# EasyEDA Pro project LeTian-robot2（轮腿机器人）.eprj, board Encoder-PCB
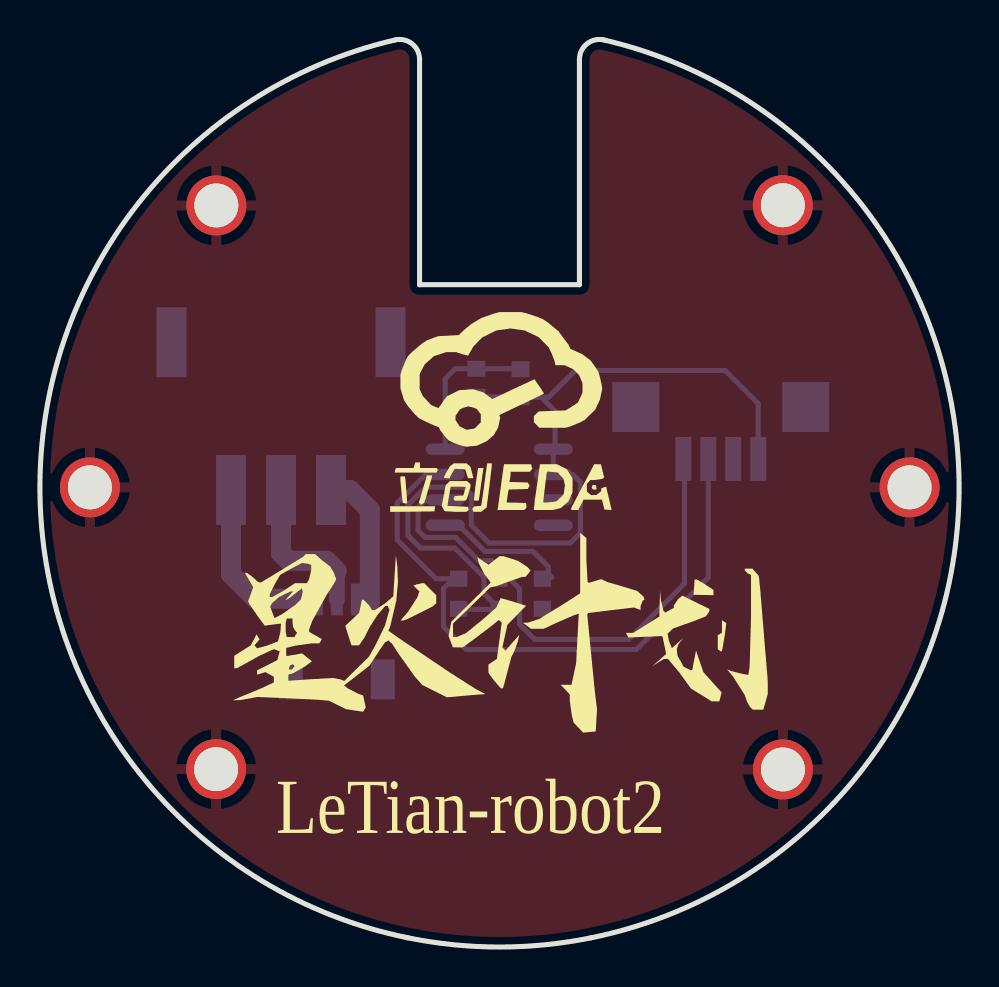
[diagram p8: board, top side]
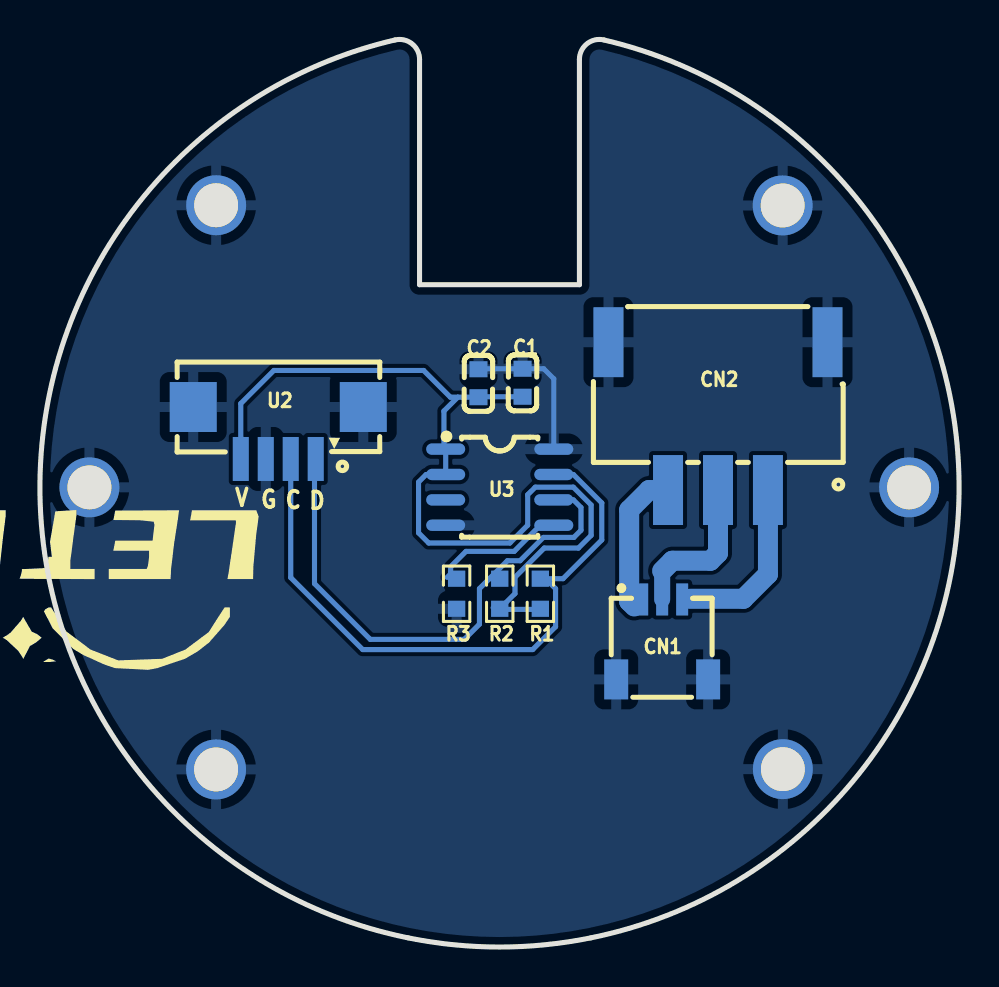
[diagram p9: board, bottom side, seen from below]

Outline 45.99 x 45.4 mm; copper layers: Top Layer, Bottom Layer. Coordinates in mm from the lower left corner of the outline.
Outline path: 17.77,45.4 arc(18.62,45.21) 19,44.42 19,33.15 27,33.15 27,44.42 arc(27.38,45.21) 28.22,45.4 arc(45.99,22.66) 27.57,0.46 arc(23,0) 18.43,0.46 arc(0,22.66) 17.77,45.4
Stack: Top Layer 0.035mm / Dielectric1 1.51mm FR4 er 4.5 / Bottom Layer 0.035mm

## Design rules (mm)
spacing safeClearance (default): track to track 0.152, other pairs 0.152 to 0.3
track width trackWidth (default): min 0.127, default 0.254, max 2.54
differential pair differentialPair (default): width min 0.127, default 0.254, max 2.54; gap min 0.152, default 0.152
via viaSize (default): diameter min 0.5, default 0.61, max 10; hole min 0.3, default 0.305, max 6

## Placement (name value [footprint] x y rotation side)
C1  0.1uF  [C0603]  21.84 28.24 90 bottom
C2  10uF  [C0603]  24.05 28.22 90 bottom
CN1  1.0K-BH-3PWB  [CONN-SMD_3P-P1.00_HDGC_1.0K-BH-3PWB]  14.86 15.4 180 bottom
CN2  WAFER-XH2.54-3PWB  [CONN-SMD_3P-P2.50_XUNPU_WAFER-XH2.54-3PWB]  12.06 26.57 0 bottom
NOREF  -  [Pad_e143]  8.82 8.9 0 top
NOREF#2  -  [Pad_e142]  37.18 8.89 0 top
NOREF#3  -  [Pad_e141]  37.18 37.13 0 top
NOREF#4  -  [Pad_e144]  2.5 23.01 0 top
NOREF#5  -  [Pad_e145]  8.83 37.12 0 top
NOREF#6  -  [Pad_e139]  43.52 23.01 0 top
R1  10k  [R0603]  20.95 17.68 90 bottom
R2  10k  [R0603]  22.98 17.68 90 bottom
R3  1k  [R0603]  25.14 17.68 90 bottom
U2  1.25-4PWTDK  [CONN-SMD_4P-P1.25_SHOUHAN_1.25-4PWTDK]  34.07 25.73 0 bottom
U3  AS5600-ASOM  [SOIC-8_L5.0-W4.0-P1.27-LS6.0-BL]  22.99 23.02 270 bottom

## Footprints (pads in the part's own frame, mm; a bottom-side part is the same pattern mirrored in y, then rotated)
C0603
  rect 0.8x0.9 smd: 1(-0.7,0) 2(0.7,0)
CONN-SMD_3P-P1.00_HDGC_1.0K-BH-3PWB
  rect 0.6x1.6 smd: 1(-1,2) 2(0,2) 3(1,2)
  rect 1.2x2 smd: 4(2.3,-2) 5(-2.3,-2)
CONN-SMD_3P-P2.50_XUNPU_WAFER-XH2.54-3PWB
  rect 1.5x3.5 smd: 1(-2.5,3.7) 2(0,3.7) 3(2.5,3.7) 4(5.48,-3.7) 5(-5.48,-3.7)
CONN-SMD_4P-P1.25_SHOUHAN_1.25-4PWTDK
  rect 0.8x2.2 smd: 1(-1.875,1.3) 2(-0.625,1.3) 3(0.625,1.3) 4(1.875,1.3)
  rect 2.35x2.5 smd: 5(4.255,-1.3) 6(-4.255,-1.3)
Pad_e139
  round 3 hole 2.2: 1(0,0)
Pad_e141
  round 3 hole 2.2: 1(0,0)
Pad_e142
  round 3 hole 2.2: 1(0,0)
Pad_e143
  round 3 hole 2.2: 1(0,0)
Pad_e144
  round 3 hole 2.2: 1(0,0)
Pad_e145
  round 3 hole 2.2: 1(0,0)
R0603
  rect 0.806x0.864 smd: 1(-0.753,0) 2(0.753,0)
SOIC-8_L5.0-W4.0-P1.27-LS6.0-BL
  oval 0.569x1.95 smd: 1(-1.905,-2.705) 2(-0.635,-2.705) 3(0.635,-2.705) 4(1.905,-2.705) 5(1.905,2.705) 6(0.635,2.705) 7(-0.635,2.705) 8(-1.905,2.705)

## Nets
As in the schematic, except:
GND: C1.2 C2.2 CN1.4 CN1.5 CN2.4 CN2.5 NOREF.1 NOREF#2.1 NOREF#3.1 NOREF#4.1 NOREF#5.1 NOREF#6.1 R3.1 U2.3 U2.5 U2.6 U3.4 U3.8

Pads without a net: U3 3

## Routing (per net, layer and track width the routed paths; a pad name or vN(x,y) marks a point on that pad's centre or on a via; arc(x,y) is an arc through that point)
3V3: length 48
  Bottom Layer w0.254: U2.4 35.94,27.2 34.29,28.86 26.79,28.86 25.46,27.52 25.09,27.52 ; 25.09,27.52 25.78,26.83 25.78,25.01 U3.1 U3.2 26.67,23.65 27.05,23.27 27.05,20.73 26.54,20.22 22.48,20.22 21.59,21.11 21.59,22.64 21.21,23.02 19.3,23.02 18.41,22.13 18.41,20.6 19.05,19.97 20.76,19.97 22.22,18.5 22.22,17.69 R2.1 ; 25.09,27.52 C2.1 24.03,27.54 C1.1 ; 23.31,16.98 23.23,16.9 21.06,16.9
GND: length 7.5
  Bottom Layer w0.254: C2.2 24.03,28.94 C1.2 20.78,28.94 20.28,28.44 U3.8
SCL: length 32.7
  Bottom Layer w0.254: U3.7 19.3,23.65 17.88,22.23 17.88,20.37 19.82,18.44 20.69,18.44 ; 20.69,18.44 21.09,18.44 21.12,18.41 ; 20.69,18.44 20.19,17.94 20.19,16.03 21.33,14.89 29.84,14.89 33.45,18.49 U2.2
SDA: length 27.2
  Bottom Layer w0.254: R2.2 23.5,18.44 ; U3.6 19.3,22.38 18.92,22 18.92,20.86 19.28,20.5 20.8,20.5 21.97,19.33 22.6,19.33 24,17.94 24,16.16 24.76,15.4 29.46,15.4 32.26,18.19 32.26,24.37 U2.1
U: length 7.3
  Bottom Layer w1: 16.25,17.05 16.51,17.3 16.51,21.87 15.51,22.87 CN2.3
V: length 7.7
  Bottom Layer w0.8: 14.86,18.83 CN1.2
  Bottom Layer w1: 14.86,18.83 14.35,19.33 12.44,19.33 12.06,19.71 CN2.2
W: length 8.6
  Bottom Layer w1: 13.46,17.43 10.79,17.43 9.56,18.66 CN2.1
$1N599: length 6.6
  Bottom Layer w0.254: 25.62,18.5 25.44,18.68 25.44,19.03 24.67,19.8 22.26,19.8 20.95,21.11 U3.5

## Copper pours and planes (outline as drawn; the poured copper is in the pictures)
GND on Top Layer: 46.35,23.5 46.31,24.46 46.23,25.41 46.11,26.37 45.95,27.31 45.76,28.25 45.52,29.19 45.25,30.11 44.94,31.02 44.59,31.91 44.2,32.79 43.78,33.65 43.32,34.5 42.83,35.32 42.3,36.13 41.75,36.91 41.16,37.67 40.53,38.4 39.88,39.11 39.2,39.79 38.5,40.44 37.76,41.06 37.01,41.65 36.23,42.21 35.42,42.73 34.6,43.22 33.75,43.68 32.89,44.1 32.01,44.49 31.11,44.84 30.2,45.15 29.28,45.42 28.35,45.66 27.41,45.86 26.46,46.01 25.51,46.13 24.55,46.21 23.59,46.25 22.63,46.25 21.67,46.21 20.72,46.13 19.76,46.01 18.82,45.86 17.88,45.66 16.94,45.42 16.02,45.15 15.11,44.84 14.22,44.49 13.34,44.1 12.48,43.68 11.63,43.22 10.81,42.73 10,42.21 9.22,41.65 8.46,41.06 7.73,40.44 7.02,39.79 6.34,39.11 5.69,38.4 5.07,37.67 4.48,36.91 3.92,36.13 3.4,35.32 2.91,34.5 2.45,33.65 2.03,32.79 1.64,31.91 1.29,31.02 0.98,30.11 0.71,29.19 0.47,28.25 0.27,27.31 0.12,26.37 0,25.41 -0.08,24.46 -0.12,23.5 -0.12,22.54 -0.08,21.58 0,20.62 0.12,19.67 0.27,18.72 0.47,17.78 0.71,16.85 0.98,15.93 1.29,15.02 1.64,14.12 2.03,13.24 2.45,12.38 2.91,11.53 3.4,10.71 3.92,9.9 4.48,9.12 5.07,8.37 5.69,7.63 6.34,6.93 7.02,6.25 7.73,5.6 8.46,4.97 9.22,4.38 10,3.83 10.81,3.3 11.63,2.81 12.48,2.35 13.34,1.93 14.22,1.54 15.11,1.19 16.02,0.88 16.94,0.61 17.88,0.37 18.82,0.18 19.76,0.02 20.72,-0.1 21.67,-0.18 22.63,-0.22 23.59,-0.22 24.55,-0.18 25.51,-0.1 26.46,0.02 27.41,0.18 28.35,0.37 29.28,0.61 30.2,0.88 31.11,1.19 32.01,1.54 32.89,1.93 33.75,2.35 34.6,2.81 35.42,3.3 36.23,3.83 37.01,4.38 37.76,4.97 38.5,5.6 39.2,6.25 39.88,6.93 40.53,7.63 41.16,8.37 41.75,9.12 42.3,9.9 42.83,10.71 43.32,11.53 43.78,12.38 44.2,13.24 44.59,14.12 44.94,15.02 45.25,15.93 45.52,16.85 45.76,17.78 45.95,18.72 46.11,19.67 46.23,20.62 46.31,21.58 46.35,22.54
GND on Bottom Layer: 46.6,23.59 46.57,24.51 46.5,25.44 46.39,26.36 46.24,27.27 46.06,28.18 45.84,29.09 45.59,29.98 45.31,30.86 44.98,31.73 44.63,32.59 44.24,33.43 43.82,34.26 43.37,35.07 42.88,35.86 42.37,36.63 41.82,37.38 41.25,38.11 40.64,38.81 40.02,39.49 39.36,40.15 38.68,40.78 37.97,41.38 37.24,41.96 36.49,42.5 35.72,43.02 34.93,43.5 34.12,43.95 33.3,44.38 32.45,44.76 31.6,45.12 30.73,45.44 29.84,45.73 28.95,45.98 28.05,46.2 27.14,46.38 26.22,46.52 25.3,46.63 24.38,46.7 23.45,46.74 22.52,46.74 21.6,46.7 20.67,46.63 19.75,46.52 18.83,46.38 17.92,46.2 17.02,45.98 16.13,45.73 15.25,45.44 14.38,45.12 13.52,44.76 12.68,44.38 11.85,43.95 11.04,43.5 10.25,43.02 9.48,42.5 8.73,41.96 8,41.38 7.3,40.78 6.61,40.15 5.96,39.49 5.33,38.81 4.73,38.11 4.15,37.38 3.61,36.63 3.09,35.86 2.61,35.07 2.15,34.26 1.73,33.43 1.34,32.59 0.99,31.73 0.67,30.86 0.38,29.98 0.13,29.09 -0.09,28.18 -0.27,27.27 -0.41,26.36 -0.52,25.44 -0.59,24.51 -0.63,23.59 -0.63,22.66 -0.59,21.73 -0.52,20.81 -0.41,19.89 -0.27,18.97 -0.09,18.06 0.13,17.16 0.38,16.26 0.67,15.38 0.99,14.51 1.34,13.66 1.73,12.81 2.15,11.99 2.61,11.18 3.09,10.39 3.61,9.62 4.15,8.86 4.73,8.14 5.33,7.43 5.96,6.75 6.61,6.09 7.3,5.46 8,4.86 8.73,4.29 9.48,3.74 10.25,3.23 11.04,2.74 11.85,2.29 12.68,1.87 13.52,1.48 14.38,1.12 15.25,0.8 16.13,0.52 17.02,0.27 17.92,0.05 18.83,-0.13 19.75,-0.28 20.67,-0.39 21.6,-0.46 22.52,-0.5 23.45,-0.5 24.38,-0.46 25.3,-0.39 26.22,-0.28 27.14,-0.13 28.05,0.05 28.95,0.27 29.84,0.52 30.73,0.8 31.6,1.12 32.45,1.48 33.3,1.87 34.12,2.29 34.93,2.74 35.72,3.23 36.49,3.74 37.24,4.29 37.97,4.86 38.68,5.46 39.36,6.09 40.02,6.75 40.64,7.43 41.25,8.14 41.82,8.86 42.37,9.62 42.88,10.39 43.37,11.18 43.82,11.99 44.24,12.81 44.63,13.66 44.98,14.51 45.31,15.38 45.59,16.26 45.84,17.16 46.06,18.06 46.24,18.97 46.39,19.89 46.5,20.81 46.57,21.73 46.6,22.66

## Text on the board
Bottom Silkscreen Layer: D | C | G | V
Top Silkscreen Layer: LeTian-robot2
